# Altium schematic sheet RTC.SchDoc
size A4
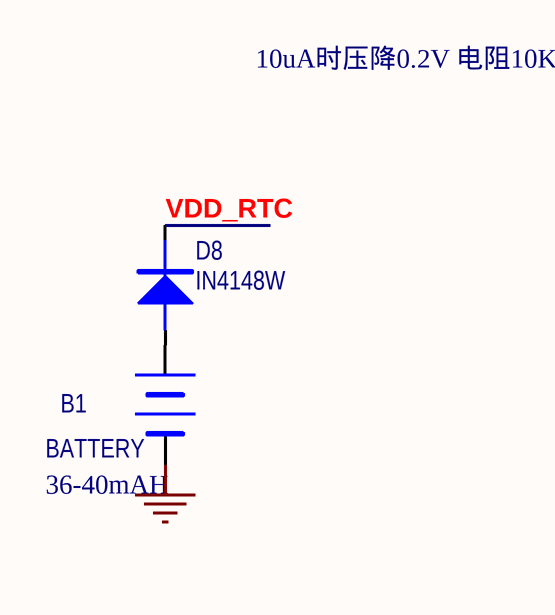
[diagram p0: RTC.SchDoc]

## Parts
B1  BATTERY  volume: 36-40mAH  [BR2032-1GV]
D8  IN4148W  [SOD123]

## Nets
GND: B1.2
VDD_RTC: D8.2
NetB1_1: B1.1 D8.1

## Notes on the sheet
- 10uA时压降0.2V 电阻10K

## Library data of the parts
B1 = BATTERY: 电池座
D8 = DIODE